# Altium project SR-BMS-Master-Ver1-RevB_lpc407x.PrjPcb
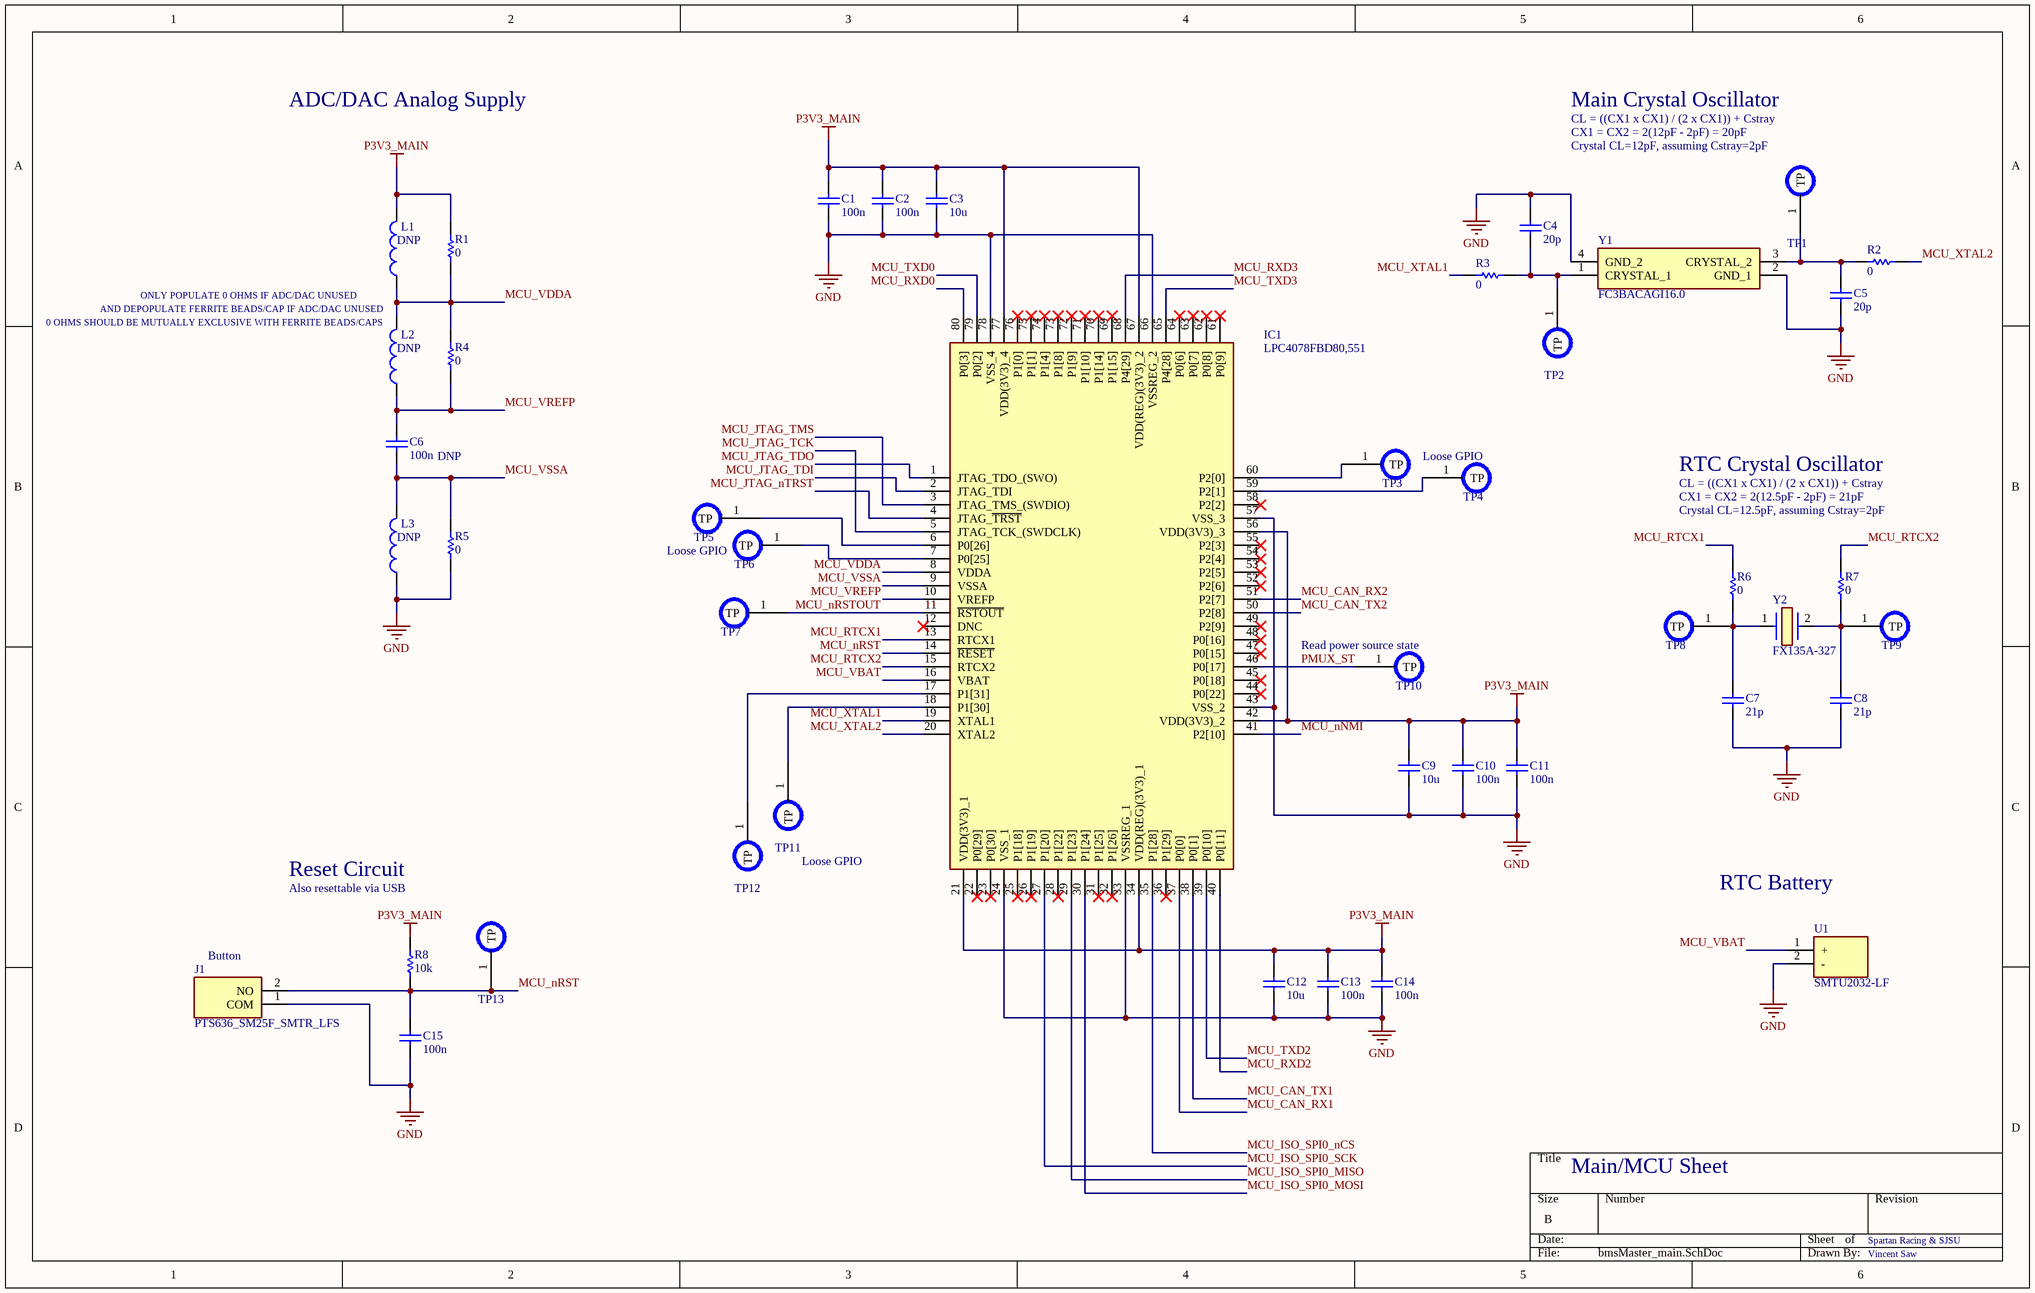
[diagram p0: bmsMaster_main.SchDoc]
7 sheets, 132 parts. Net scope: global (net labels, ports and power ports of the same name join across sheets).
Board file: bmsMaster.PcbDoc
Sheets:
  bmsMaster_main.SchDoc
  bmsMaster_conn.SchDoc
  bmsMaster_power.SchDoc
  bmsMaster_usb.SchDoc
  bmsMaster_isospi.SchDoc
  bmsMaster_can.SchDoc
  bmsMaster_led.SchDoc

## Sheet bmsMaster_main.SchDoc
size B; SheetNumber: 1; SheetTotal: 7

### Parts
C1  value 100n  [CAPC1608X90N]  (hidden comment: Capacitor)
C2  value 100n  [CAPC1608X90N]  (hidden comment: Capacitor)
C3  value 10u  [CAPC1608X90N]  (hidden comment: Capacitor)
C4  value 20p  [CAPC1608X90N]  (hidden comment: Capacitor)
C5  value 20p  [CAPC1608X90N]  (hidden comment: Capacitor)
C6  value 100n  [CAPC1608X90N]  (hidden comment: Capacitor)
C7  value 21p  [CAPC1608X90N]  (hidden comment: Capacitor)
C8  value 21p  [CAPC1608X90N]  (hidden comment: Capacitor)
C9  value 10u  [CAPC1608X90N]  (hidden comment: Capacitor)
C10  value 100n  [CAPC1608X90N]  (hidden comment: Capacitor)
C11  value 100n  [CAPC1608X90N]  (hidden comment: Capacitor)
C12  value 10u  [CAPC1608X90N]  (hidden comment: Capacitor)
C13  value 100n  [CAPC1608X90N]  (hidden comment: Capacitor)
C14  value 100n  [CAPC1608X90N]  (hidden comment: Capacitor)
C15  value 100n  [CAPC1608X90N]  (hidden comment: Capacitor)
IC1  LPC4078FBD80,551  [QFP50P1400X1400X160-80N]
J1  PTS636_SM25F_SMTR_LFS  [PTS636SM25FSMTRLFS]
L1  Inductor  [BEADC1608X95N]  (value not drawn)
L2  Inductor  [BEADC1608X95N]  (value not drawn)
L3  Inductor  [BEADC1608X95N]  (value not drawn)
R1  value 0  [RESC1608X50N]  (hidden comment: Resistor)
R2  value 0  [RESC1608X50N]  (hidden comment: Resistor)
R3  value 0  [RESC1608X50N]  (hidden comment: Resistor)
R4  value 0  [RESC1608X50N]  (hidden comment: Resistor)
R5  value 0  [RESC1608X50N]  (hidden comment: Resistor)
R6  value 0  [RESC1608X50N]  (hidden comment: Resistor)
R7  value 0  [RESC1608X50N]  (hidden comment: Resistor)
R8  value 10k  [RESC1608X50N]  (hidden comment: Resistor)
TP1  TSTPT  [Testpoint1]  (value not drawn)  (no BOM)
TP2  TSTPT  [Testpoint1]  (value not drawn)  (no BOM)
TP3  TSTPT  [Testpoint1]  (value not drawn)  (no BOM)
TP4  TSTPT  [Testpoint1]  (value not drawn)  (no BOM)
TP5  TSTPT  [Testpoint1]  (value not drawn)  (no BOM)
TP6  TSTPT  [Testpoint1]  (value not drawn)  (no BOM)
TP7  TSTPT  [Testpoint1]  (value not drawn)  (no BOM)
TP8  TSTPT  [Testpoint1]  (value not drawn)  (no BOM)
TP9  TSTPT  [Testpoint1]  (value not drawn)  (no BOM)
TP10  TSTPT  [Testpoint1]  (value not drawn)  (no BOM)
TP11  TSTPT  [Testpoint1]  (value not drawn)  (no BOM)
TP12  TSTPT  [Testpoint1]  (value not drawn)  (no BOM)
TP13  TSTPT  [Testpoint1]  (value not drawn)  (no BOM)
U1  SMTU2032-LF  [SMTU2032LF]
Y1  FC3BACAGI16.0  [FC3BACAGI160]
Y2  FX135A-327  [FX135A327]

### Nets
GND: C1.1 C2.1 C3.1 C4.2 C5.1 C7.1 C8.1 C9.1 C10.1 C11.1 C12.1 C13.1 C14.1 C15.1 IC1.24(VSS_1) IC1.33(VSSREG_1) IC1.43(VSS_2) IC1.57(VSS_3) IC1.66(VSSREG_2) IC1.78(VSS_4) J1.1(COM) L3.1 R5.1 U1.2(-) Y1.2(GND_1) Y1.4(GND_2)
P3V3_MAIN: C1.2 C2.2 C3.2 C9.2 C10.2 C11.2 C12.2 C13.2 C14.2 IC1.21(VDD(3V3)_1) IC1.34(VDD(REG)(3V3)_1) IC1.42(VDD(3V3)_2) IC1.56(VDD(3V3)_3) IC1.67(VDD(REG)(3V3)_2) IC1.77(VDD(3V3)_4) L1.2 R1.2 R8.2
MCU_CAN_RX1: IC1.37(P0[0])
MCU_CAN_RX2: IC1.51(P2[7])
MCU_CAN_TX1: IC1.38(P0[1])
MCU_CAN_TX2: IC1.50(P2[8])
MCU_ISO_SPI0_MISO: IC1.29(P1[23])
MCU_ISO_SPI0_MOSI: IC1.30(P1[24])
MCU_ISO_SPI0_nCS: IC1.35(P1[28])
MCU_ISO_SPI0_SCK: IC1.27(P1[20])
MCU_JTAG_nTRST: IC1.4(JTAG_~{TRST})
MCU_JTAG_TCK: IC1.5(JTAG_TCK_(SWDCLK))
MCU_JTAG_TDI: IC1.2(JTAG_TDI)
MCU_JTAG_TDO: IC1.1(JTAG_TDO_(SWO))
MCU_JTAG_TMS: IC1.3(JTAG_TMS_(SWDIO))
MCU_nNMI: IC1.41(P2[10])
MCU_nRST: C15.2 IC1.14(~{RESET}) J1.2(NO) R8.1 TP13.1(TP)
MCU_nRSTOUT: IC1.11(~{RSTOUT}) TP7.1(TP)
MCU_RTCX1: IC1.13(RTCX1) R6.1
MCU_RTCX2: IC1.15(RTCX2) R7.1
MCU_RXD0: IC1.80(P0[3])
MCU_RXD2: IC1.40(P0[11])
MCU_RXD3: IC1.68(P4[29])
MCU_TXD0: IC1.79(P0[2])
MCU_TXD2: IC1.39(P0[10])
MCU_TXD3: IC1.65(P4[28])
MCU_VBAT: IC1.16(VBAT) U1.1(+)
MCU_VDDA: IC1.8(VDDA) L1.1 L2.2 R1.1 R4.2
MCU_VREFP: C6.2 IC1.10(VREFP) L2.1 R4.1
MCU_VSSA: C6.1 IC1.9(VSSA) L3.2 R5.2
MCU_XTAL1: IC1.19(XTAL1) R3.2
MCU_XTAL2: IC1.20(XTAL2) R2.1
PMUX_ST: IC1.46(P0[17]) TP10.1(TP)
NetC4_1: C4.1 R3.1 TP2.1(TP) Y1.1(CRYSTAL_1)
NetC5_2: C5.2 R2.2 TP1.1(TP) Y1.3(CRYSTAL_2)
NetC7_2: C7.2 R6.2 TP8.1(TP) Y2.1
NetC8_2: C8.2 R7.2 TP9.1(TP) Y2.2
NetIC1_6: IC1.6(P0[26]) TP5.1(TP)
NetIC1_7: IC1.7(P0[25]) TP6.1(TP)
NetIC1_17: IC1.17(P1[31]) TP12.1(TP)
NetIC1_18: IC1.18(P1[30]) TP11.1(TP)
NetIC1_59: IC1.59(P2[1]) TP4.1(TP)
NetIC1_60: IC1.60(P2[0]) TP3.1(TP)

Not connected (* = marked no-connect by the designer): IC1 12(DNC)* 22(P0[29])* 23(P0[30])* 25(P1[18])* 26(P1[19])* 28(P1[22])* 31(P1[25])* 32(P1[26])* 36(P1[29])* 44(P0[22])* 45(P0[18])* 47(P0[15])* 48(P0[16])* 49(P2[9])* 52(P2[6])* 53(P2[5])* 54(P2[4])* 55(P2[3])* 58(P2[2])* 61(P0[9])* 62(P0[8])* 63(P0[7])* 64(P0[6])* 69(P1[15])* 70(P1[14])* 71(P1[10])* 72(P1[9])* 73(P1[8])* 74(P1[4])* 75(P1[1])* 76(P1[0])*

### Notes on the sheet
- ADC/DAC Analog Supply
- Main Crystal Oscillator
- CL = ((CX1 x CX1) / (2 x CX1)) + Cstray
- CX1 = CX2 = 2(12pF - 2pF) = 20pF
- (near TP1) Crystal CL=12pF, assuming Cstray=2pF
- ONLY POPULATE 0 OHMS IF ADC/DAC UNUSED
- (near L1) DNP
- 0 OHMS SHOULD BE MUTUALLY EXCLUSIVE WITH FERRITE BEADS/CAPS
- AND DEPOPULATE FERRITE BEADS/CAP IF ADC/DAC UNUSED
- (near L2) DNP
- (near C6) DNP
- (near TP4) Loose GPIO
- RTC Crystal Oscillator
- CX1 = CX2 = 2(12.5pF - 2pF) = 21pF
- (near L3) DNP
- Loose GPIO
- Crystal CL=12.5pF, assuming Cstray=2pF
- (near TP10) Read power source state
- Reset Circuit
- Also resettable via USB
- RTC Battery
- (near J1) Button
- Main/MCU Sheet
- Spartan Racing & SJSU
- Vincent Saw

### Library data of the parts
C1-C15 = Capacitor: SimulationGenericComponent: True
IC1 = LPC4078FBD80,551: Integrated Circuit; Manufacturer_Name: NXP; Datasheet Link: http://www.nxp.com/docs/en/data-sheet/LPC408X_7X.pdf; Height: 1.6mm; Manufacturer_Part_Number: LPC4078FBD80,551; Mouser Part Number: 771-LPC4078FBD80551; Mouser Price/Stock: https://www.mouser.co.uk/ProductDetail/NXP-Semiconductors/LPC4078FBD80551?qs=vnbNJPHmPnPMtBCcoSguaA%3D%3D; Arrow Part Number: LPC4078FBD80,551; Arrow Price/Stock: https://www.arrow.com/en/products/lpc4078fbd80551/nxp-semiconductors
J1 = PTS636_SM25F_SMTR_LFS: Connector; Manufacturer_Name: C & K COMPONENTS; Manufacturer_Part_Number: PTS636 SM25F SMTR LFS; Datasheet Link: https://ms.componentsearchengine.com/Datasheets/1/PTS636 SM25F SMTR LFS.pdf; Height: 2.7mm; Mouser Part Number: 611-PTS636SM25FSMTRL; Mouser Price/Stock: https://www.mouser.co.uk/ProductDetail/CK/PTS636-SM25F-SMTR-LFS?qs=vLWxofP3U2wcBTQSwfMFOw%3D%3D; Arrow Part Number: PTS636 SM25F SMTR LFS; Arrow Price/Stock: https://www.arrow.com/en/products/pts636-sm25f-smtr-lfs/ck
L1-L3 = Inductor: SimulationGenericComponent: True
R1-R7 = Resistor: SimulationGenericComponent: True; TC1: 0; TC2: 0
R8 = Resistor: TC1: 0; SimulationGenericComponent: True; TC2: 0
TP1-TP13 = Testpoint1
U1 = SMTU2032-LF: Undefined or Miscellaneous; Manufacturer_Name: RENATA; Datasheet Link: https://componentsearchengine.com/Datasheets/1/SMTU2032-LF.pdf; Height: 5mm; Manufacturer_Part_Number: SMTU2032-LF; Mouser Part Number: 614-SMTU2032-LF; Mouser Price/Stock: https://www.mouser.co.uk/ProductDetail/Renata/SMTU2032-LF?qs=r1PAtlylphCLeXbokB9Tog%3D%3D
Y1 = FC3BACAGI16.0: Crystal or Oscillator; Manufacturer_Name: Fox; Datasheet Link: https://www.foxonline.com/wp-content/uploads/pdfs/C3BA.pdf; Height: 0.8mm; Manufacturer_Part_Number: FC3BACAGI16.0; Mouser Part Number: 559-FC3BACAGI16.0; Mouser Price/Stock: https://www.mouser.co.uk/ProductDetail/Fox/FC3BACAGI160?qs=W0yvOO0ixfHpyQil83gR7Q%3D%3D
Y2 = FX135A-327: Crystal or Oscillator; Manufacturer_Name: Fox; Datasheet Link: https://componentsearchengine.com/Datasheets/2/FX135A-327.pdf; Height: 0.9mm; Manufacturer_Part_Number: FX135A-327; Mouser Part Number: 559-FX135A-327; Mouser Price/Stock: https://www.mouser.co.uk/ProductDetail/Fox-Abracon/FX135A-327?qs=n5MbhIql%252BRlKJidsig7mKQ%3D%3D

## Sheet bmsMaster_conn.SchDoc
size A; SheetNumber: 2; SheetTotal: 7
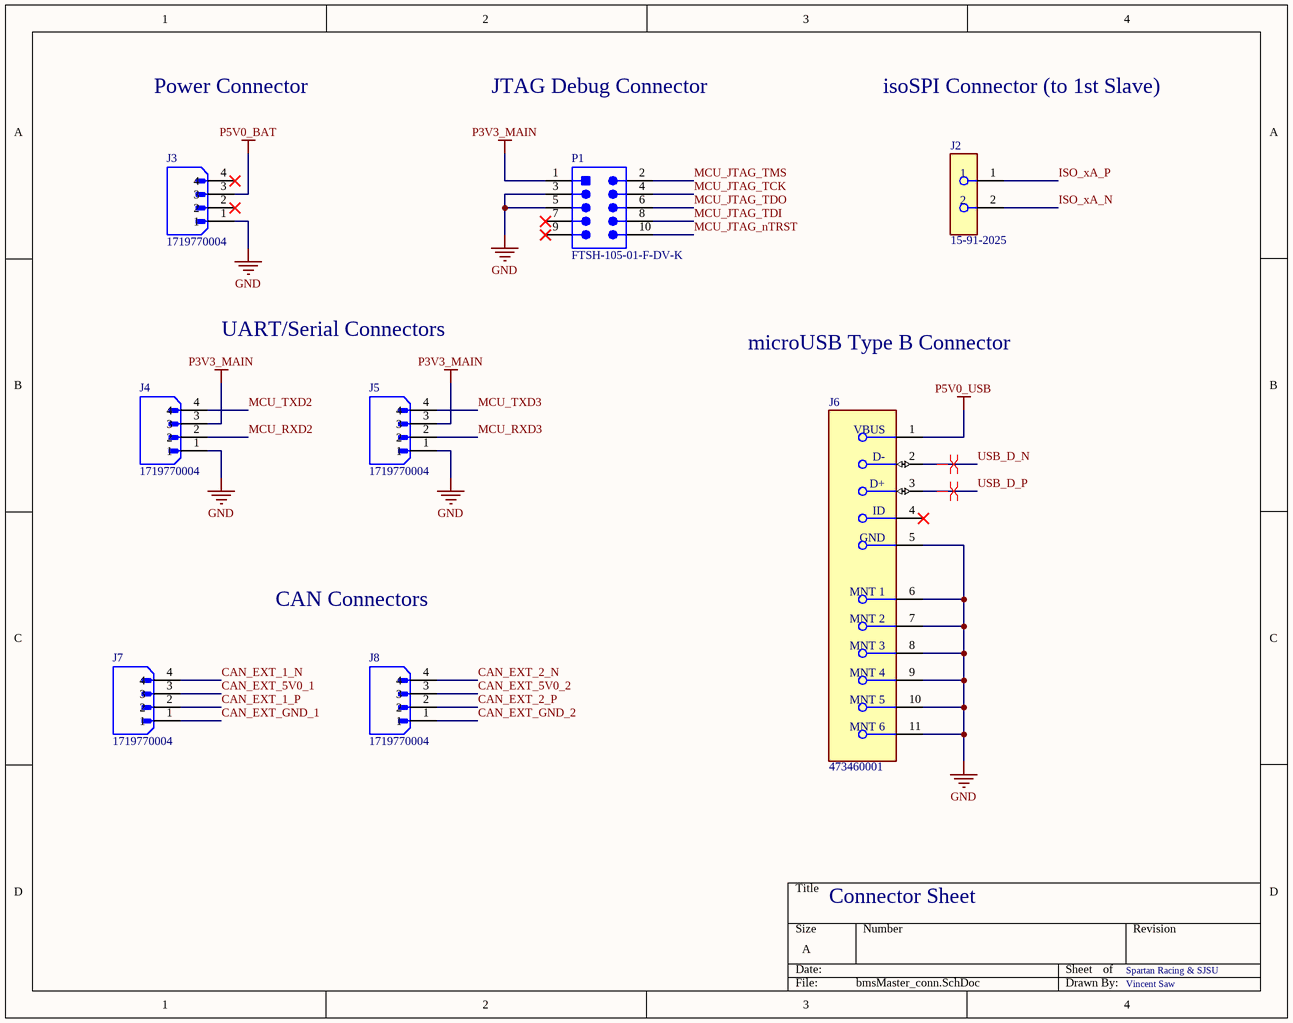
[diagram p1: bmsMaster_conn.SchDoc]

### Parts
J2  15-91-2025  [FP-15-91-2025-MFG]
J3  1719770004  [MOLEX_1719770004]
J4  1719770004  [MOLEX_1719770004]
J5  1719770004  [MOLEX_1719770004]
J6  473460001  [FP-473460001-MFG]
J7  1719770004  [MOLEX_1719770004]
J8  1719770004  [MOLEX_1719770004]
P1  FTSH-105-01-F-DV-K  [SMTC-FTSH-105-01-L-DV-K_V]

### Nets
GND: J3.1 J4.1 J5.1 J6.5(GND) J6.6(MNT_1) J6.7(MNT_2) J6.8(MNT_3) J6.9(MNT_4) J6.10(MNT_5) J6.11(MNT_6) P1.3 P1.5
P3V3_MAIN: J4.3 J5.3 P1.1
P5V0_BAT: J3.3
P5V0_USB: J6.1(VBUS)
CAN_EXT_1_N: J7.4
CAN_EXT_1_P: J7.2
CAN_EXT_2_N: J8.4
CAN_EXT_2_P: J8.2
CAN_EXT_5V0_1: J7.3
CAN_EXT_5V0_2: J8.3
CAN_EXT_GND_1: J7.1
CAN_EXT_GND_2: J8.1
ISO_xA_N: J2.2
ISO_xA_P: J2.1
MCU_JTAG_nTRST: P1.10
MCU_JTAG_TCK: P1.4
MCU_JTAG_TDI: P1.8
MCU_JTAG_TDO: P1.6
MCU_JTAG_TMS: P1.2
MCU_RXD2: J4.2
MCU_RXD3: J5.2
MCU_TXD2: J4.4
MCU_TXD3: J5.4
USB_D_N: J6.2(D-)
USB_D_P: J6.3(D+)

Not connected (* = marked no-connect by the designer): J3 2* 4*; J6 4(ID)*; P1 7* 9*

### Layout directives
differential pair: USB_D_N, USB_D_P

### Notes on the sheet
- Power Connector
- JTAG Debug Connector
- isoSPI Connector (to 1st Slave)
- UART/Serial Connectors
- microUSB Type B Connector
- CAN Connectors
- Connector Sheet
- Spartan Racing & SJSU
- Vincent Saw

### Library data of the parts
J2 = CMP-04776-000618-1: CONN HEADER SMD R/A 2POS 2.54MM; Number of Contacts: 2; Voltage Rating: 250V; Max Current Rating: 1.75A; Contact Resistance: 30mR; Current Rating: 3A; Insulation Resistance: 1GR; Gender: Male; Glow Wire Compliant: Non-compliant; Contact Mating Length: 0.24inch; Max Operating Temperature: 105°C; Length: 8.64mm; Color: Black; REACH SVHC: No SVHC; Depth: 13.59mm; ELV: Compliant; Material: Brass; Contact Type: Male Pin; Number of Rows: 1; Number of Positions: 2; Housing Color: Black; Pitch: 2.54mm; Housing Material: Polyester; Flammability Rating: UL94 V-0; Packaging: Rail/Tube; RoHS Compliant: Yes; Radiation Hardening: No; Min Operating Temperature: -40°C; Termination: Solder; Mount: Surface Mount; Contact Plating: Gold; Package Quantity: 1830; Height: 5.56mm; Contact Material: Bronze; Orientation: Right Angle; Number of Circuits: 2; Lead Free: Contains Lead; Voltage Rating (DC): 250V; Series: C-Grid® SL™ 70634; Contact Gender: Male
J3-J5 J7 J8 = 1719770004: 2.54mm Pitch SL Header, Single Row, Right-Angle, LCP, Shrouded, Surface Mount, with Pegs, Matte Tin (Sn) Plating, 4 Circuits, Tube; MF: {'manufacturer': u'Molex'}; Price: None; Value: *; MP: 1719770004; Package: None; Availability: Unavailable
J6 = CMP-2000-05246-2: CONN RCPT USB2.0 MICRO B SMD R/A; Manufacturer: Molex; Conn Orientation: Right Angle; Is Female: yes; Shielding: true; Pitch: 0.65mm; Number Of Contacts: 5; Voltage Rating: 30V; Current Rating: 1.8A; Device Class L2: USB Connectors; Digikey Description: CONN RCPT USB2.0 MICRO B SMD R/A; Height: 2.945mm; RoHS: TRUE; ComponentLink2Description: Datasheet; Octopart: https://octopart.com/47346-0001-molex-7164928; Automotive: No; Package: 0; Category: Conn; Device Class L1: Connectors; Usb Standard: USB 2.0; Temperature: -30°C to +85°C; Temperature Range Low: -30°C; Footprint Url: https://www.molex.com/pdm_docs/sd/473460001_sd.pdf; ComponentLink2URL: https://www.molex.com/webdocs/datasheets/pdf/en-us/0473460001_IO_CONNECTORS.pdf; Lead Free: Yes; Manufacturer Part Number: 473460001; Contact Material: Gold,Nickel; Temperature Range High: +85°C; Device Class L3: unset
P1 = CMP-2000-05352-1: Male Header, Pitch 1.27 mm, 2 x 5 Position, Height 6.12 mm, RoHS, Tube; Manufacturer: Samtec; Number of Positions: 10; Connector Type: Header,Shrouded; Number of Positions Loaded: All; Row Spacing: 0.050"(1.27mm); Fastening Type: -; Package Reference: FTSH-105-01-L-DV-K; Termination: Solder; Package URL: http://suddendocs.samtec.com/prints/ftsh-1xx-xx-xxx-dv-xxx-footprint.pdf; Number of Rows: 2; Contact Finish Thickness: 3µin(0.08µm); Contact Type: MalePin; Manufacturer URL: http://www.samtec.com/; Contact Mating Length: 0.120"(3.05mm); Pitch: 0.050"(1.27mm); Series: FTSH; Features: -; Contact Finish: Gold; Color: Black; Family: RectangularConnectors-Headers,MalePins; Datasheet URL: http://suddendocs.samtec.com/prints/ftsh-1xx-xx-xxx-dv-xxx-mkt.pdf; Package Description: Male Header, Pitch 1.27 mm, 2 x 5 Position, Height 5.97 mm, Tail Length 4.32 mm; Mounting Type: SurfaceMount; Datasheet Version: Rev. ET, 10/1995; Category: Connectors,Interconnects; Packaging: Tube

## Sheet bmsMaster_power.SchDoc
size A; SheetNumber: 3; SheetTotal: 7
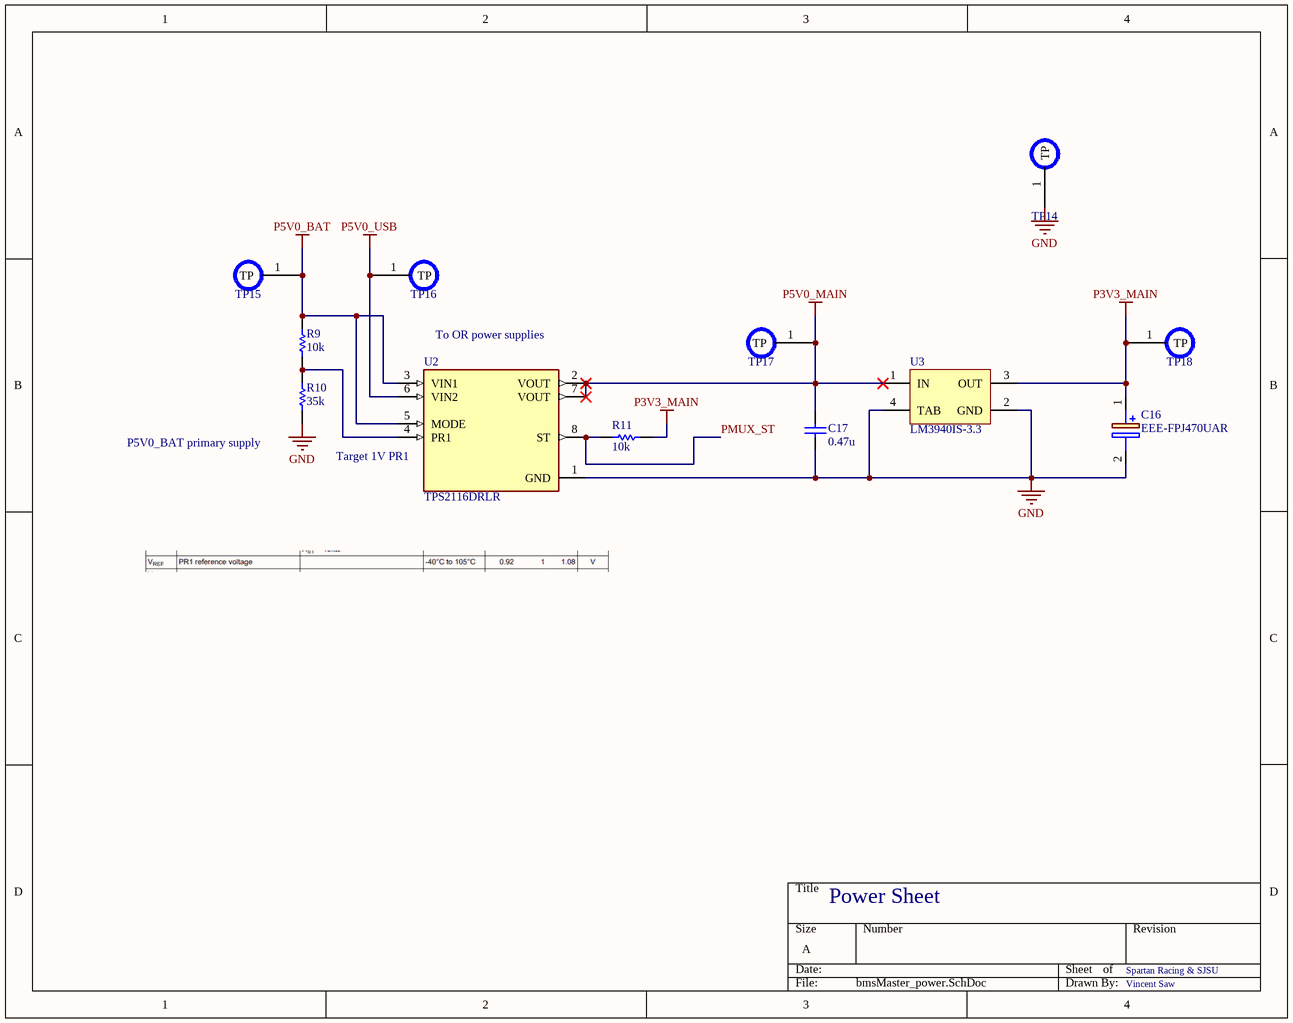
[diagram p2: bmsMaster_power.SchDoc]

### Parts
C16  EEE-FPJ470UAR  [EEE1AA220WR]
C17  value 0.47u  [CAPC1608X90N]  (hidden comment: Capacitor)
R9  value 10k  [RESC1608X50N]  (hidden comment: Resistor)
R10  value 35k  [RESC1608X50N]  (hidden comment: Resistor)
R11  value 10k  [RESC1608X50N]  (hidden comment: Resistor)
TP14  TSTPT  [Testpoint1]  (value not drawn)  (no BOM)
TP15  TSTPT  [Testpoint1]  (value not drawn)  (no BOM)
TP16  TSTPT  [Testpoint1]  (value not drawn)  (no BOM)
TP17  TSTPT  [Testpoint1]  (value not drawn)  (no BOM)
TP18  TSTPT  [Testpoint1]  (value not drawn)  (no BOM)
U2  TPS2116DRLR  [SOTFL50P160X60-8N]
U3  LM3940IS-3.3  [KTT0003B_N]

### Nets
GND: C16.2(-) C17.1 R10.1 TP14.1(TP) U2.1(GND) U3.2(GND) U3.4(TAB)
P3V3_MAIN: C16.1(+) R11.1 TP18.1(TP) U3.3(OUT)
P5V0_BAT: R9.2 TP15.1(TP) U2.3(VIN1) U2.5(MODE)
P5V0_MAIN: C17.2 TP17.1(TP) U2.2(VOUT) U2.7(VOUT) U3.1(IN)
P5V0_USB: TP16.1(TP) U2.6(VIN2)
PMUX_ST: R11.2 U2.8(ST)
NetR9_1: R9.1 R10.2 U2.4(PR1)

### Notes on the sheet
- To OR power supplies
- (near R10) P5V0_BAT primary supply
- (near U2) Target 1V PR1
- Power Sheet
- Spartan Racing & SJSU
- Vincent Saw

### Library data of the parts
C16 = EEE-FPJ470UAR: Capacitor Polarised; Manufacturer_Name: Panasonic; Datasheet Link: http://industrial.panasonic.com/cdbs/www-data/pdf/RDE0000/ABA0000C1184.pdf; Height: 5.5mm; Manufacturer_Part_Number: EEE-FPJ470UAR; Mouser Part Number: 667-EEE-FPJ470UAR; Mouser Price/Stock: https://www.mouser.com/Search/Refine.aspx?Keyword=667-EEE-FPJ470UAR
C17 = Capacitor: SimulationGenericComponent: True
R9-R11 = Resistor: TC1: 0; SimulationGenericComponent: True; TC2: 0
TP14-TP18 = Testpoint1
U2 = TPS2116DRLR: 1.6 V to 5.5 V, 2.5-A Low IQ Power Mux with Manual and Priority Switchover; MF: {'manufacturer': u'Texas Instruments'}; Value: *; Price: None; Package: None; Availability: Unavailable; MP: TPS2116DRLR
U3 = CMP-0062-00201-4: 1A Low Dropout Regulator for 5V to 3.3V Conversion, 3-pin TO-263; Manufacturer: Texas Instruments; CompType: LDO IC; PowerWise: N; PackageTopMarking: NSUZXYTTE#*LM3940IS*-3.3 P+; PinCount: 3; Code_JEDEC: MO-169-AA; PackageReference: KTT0003B; ComponentLink1URL: http://www.ti.com/general/docs/lit/getliterature.tsp?genericPartNumber=LM3940&fileType=pdf; RoHS: N; PackageDescription: TO-263, Molded, .400 x .390 x .180in, 3 Lead, .1in Pitch, Surface Mount; ComponentLink1Description: Datasheet URL

## Sheet bmsMaster_usb.SchDoc
size A; SheetNumber: 4; SheetTotal: 7
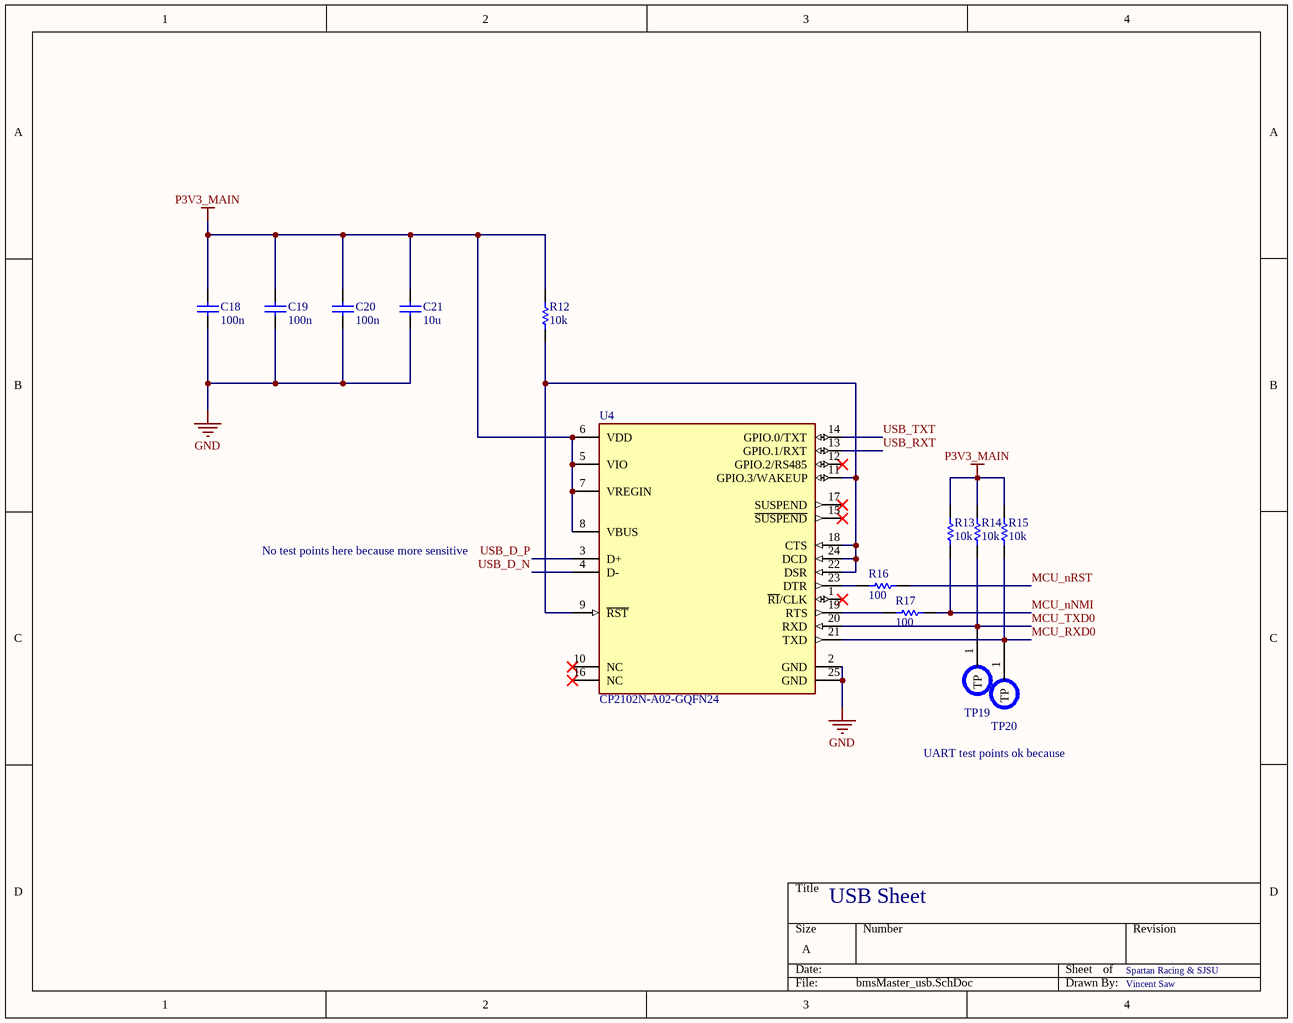
[diagram p3: bmsMaster_usb.SchDoc]

### Parts
C18  value 100n  [CAPC1608X90N]  (hidden comment: Capacitor)
C19  value 100n  [CAPC1608X90N]  (hidden comment: Capacitor)
C20  value 100n  [CAPC1608X90N]  (hidden comment: Capacitor)
C21  value 10u  [CAPC1608X90N]  (hidden comment: Capacitor)
R12  value 10k  [RESC1608X50N]  (hidden comment: Resistor)
R13  value 10k  [RESC1608X50N]  (hidden comment: Resistor)
R14  value 10k  [RESC1608X50N]  (hidden comment: Resistor)
R15  value 10k  [RESC1608X50N]  (hidden comment: Resistor)
R16  value 100  [RESC1608X50N]  (hidden comment: Resistor)
R17  value 100  [RESC1608X50N]  (hidden comment: Resistor)
TP19  TSTPT  [Testpoint1]  (value not drawn)  (no BOM)
TP20  TSTPT  [Testpoint1]  (value not drawn)  (no BOM)
U4  CP2102N-A02-GQFN24  [FP-CP2102N-A02-GQFN24-MFG]

### Nets
GND: C18.1 C19.1 C20.1 C21.1 U4.2(GND) U4.25(GND)
P3V3_MAIN: C18.2 C19.2 C20.2 C21.2 R12.2 R13.2 R14.2 R15.2 U4.5(VIO) U4.6(VDD) U4.7(VREGIN) U4.8(VBUS)
MCU_nNMI: R13.1 R17.1
MCU_nRST: R16.1
MCU_RXD0: R15.1 TP20.1(TP) U4.21(TXD)
MCU_TXD0: R14.1 TP19.1(TP) U4.20(RXD)
USB_D_N: U4.4(D-)
USB_D_P: U4.3(D+)
USB_RXT: U4.13(GPIO.1/RXT)
USB_TXT: U4.14(GPIO.0/TXT)
NetR12_1: R12.1 U4.9(~{RST}) U4.11(GPIO.3/WAKEUP) U4.18(CTS) U4.22(DSR) U4.24(DCD)
NetR16_2: R16.2 U4.23(DTR)
NetR17_2: R17.2 U4.19(RTS)

Not connected (* = marked no-connect by the designer): U4 1(~{RI}/CLK)* 10(NC)* 12(GPIO.2/RS485)* 15(~{SUSPEND})* 16(NC)* 17(SUSPEND)*

### Notes on the sheet
- No test points here because more sensitive
- UART test points ok because
- USB Sheet
- Spartan Racing & SJSU
- Vincent Saw

### Library data of the parts
C18-C21 = Capacitor: SimulationGenericComponent: True
R12-R17 = Resistor: TC1: 0; SimulationGenericComponent: True; TC2: 0
TP19 TP20 = Testpoint1
U4 = CMP-08107-000010-1: IC USB TO UART BRIDGE QFN24

## Sheet bmsMaster_isospi.SchDoc
size A; SheetNumber: 5; SheetTotal: 7
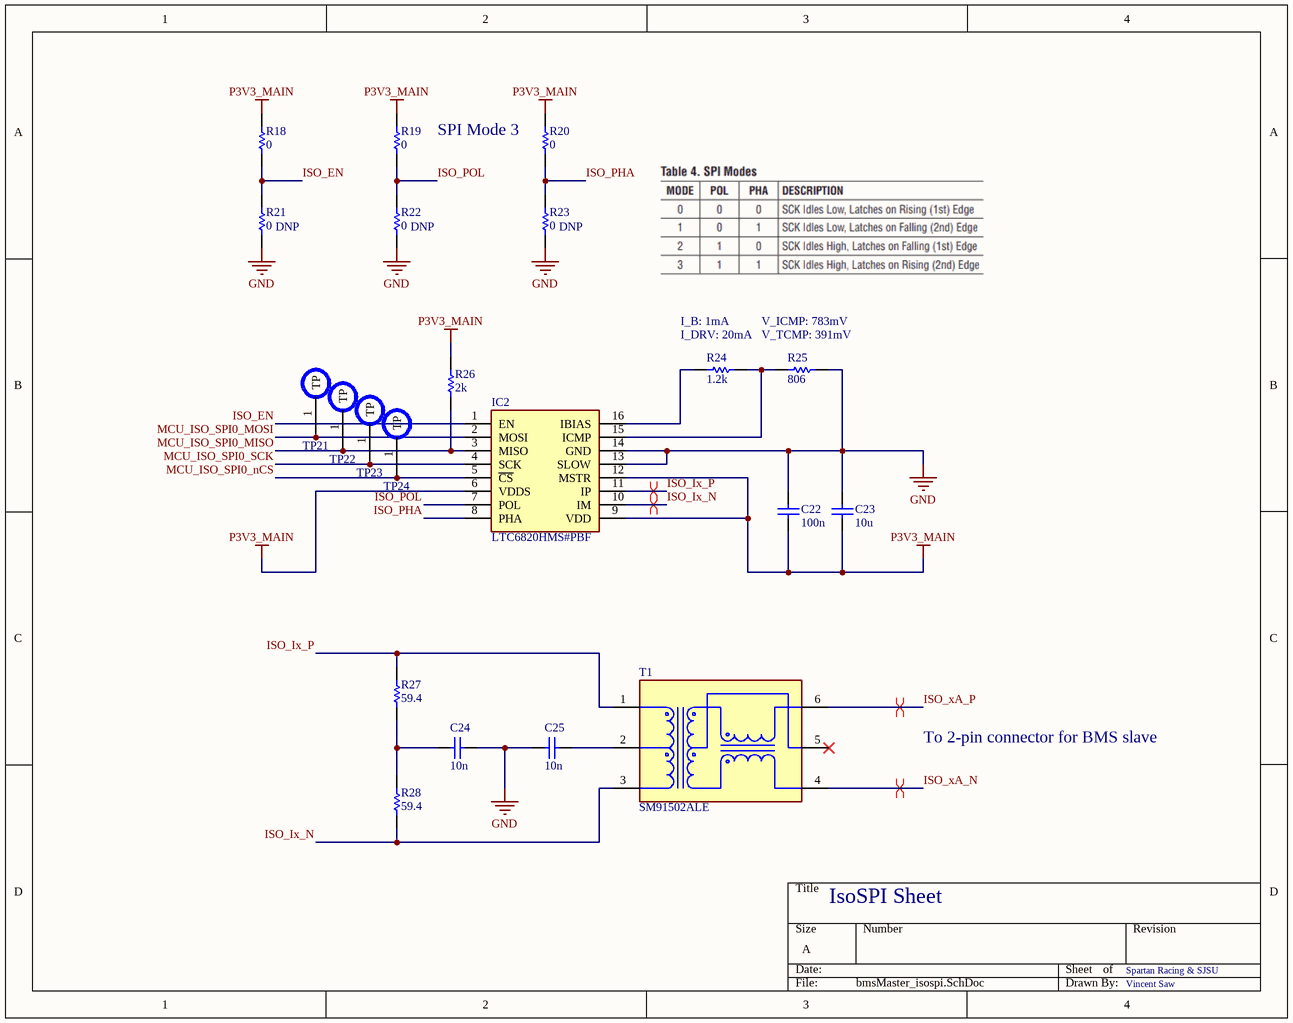
[diagram p4: bmsMaster_isospi.SchDoc]

### Parts
C22  value 100n  [CAPC1608X90N]  (hidden comment: Capacitor)
C23  value 10u  [CAPC1608X90N]  (hidden comment: Capacitor)
C24  value 10n  [CAPC1608X90N]  (hidden comment: Capacitor)
C25  value 10n  [CAPC1608X90N]  (hidden comment: Capacitor)
IC2  LTC6820HMS#PBF  [SOP50P490X110-16N]
R18  value 0  [RESC1608X50N]  (hidden comment: Resistor)
R19  value 0  [RESC1608X50N]  (hidden comment: Resistor)
R20  value 0  [RESC1608X50N]  (hidden comment: Resistor)
R21  value 0  [RESC1608X50N]  (hidden comment: Resistor)
R22  value 0  [RESC1608X50N]  (hidden comment: Resistor)
R23  value 0  [RESC1608X50N]  (hidden comment: Resistor)
R24  value 1.2k  [RESC1608X50N]  (hidden comment: Resistor)
R25  value 806  [RESC1608X50N]  (hidden comment: Resistor)
R26  value 2k  [RESC1608X50N]  (hidden comment: Resistor)
R27  value 59.4  [RESC1608X50N]  (hidden comment: Resistor)
R28  value 59.4  [RESC1608X50N]  (hidden comment: Resistor)
T1  SM91502ALE  [FP-SM91502ALE-MFG]
TP21  TSTPT  [Testpoint1]  (value not drawn)  (no BOM)
TP22  TSTPT  [Testpoint1]  (value not drawn)  (no BOM)
TP23  TSTPT  [Testpoint1]  (value not drawn)  (no BOM)
TP24  TSTPT  [Testpoint1]  (value not drawn)  (no BOM)

### Nets
GND: C22.2 C23.2 C24.1 C25.1 IC2.13(SLOW) IC2.14(GND) R21.1 R22.1 R23.1 R25.2
P3V3_MAIN: C22.1 C23.1 IC2.6(VDDS) IC2.9(VDD) IC2.12(MSTR) R18.2 R19.2 R20.2 R26.2
ISO_EN: IC2.1(EN) R18.1 R21.2
ISO_Ix_N: IC2.10(IM) R28.1 T1.3
ISO_Ix_P: IC2.11(IP) R27.2 T1.1
ISO_PHA: IC2.8(PHA) R20.1 R23.2
ISO_POL: IC2.7(POL) R19.1 R22.2
ISO_xA_N: T1.4
ISO_xA_P: T1.6
MCU_ISO_SPI0_MISO: IC2.3(MISO) R26.1 TP22.1(TP)
MCU_ISO_SPI0_MOSI: IC2.2(MOSI) TP21.1(TP)
MCU_ISO_SPI0_nCS: IC2.5(~{CS}) TP24.1(TP)
MCU_ISO_SPI0_SCK: IC2.4(SCK) TP23.1(TP)
NetC24_2: C24.2 R27.1 R28.2
NetC25_2: C25.2 T1.2
NetIC2_15: IC2.15(ICMP) R24.2 R25.1
NetIC2_16: IC2.16(IBIAS) R24.1

Not connected (* = marked no-connect by the designer): T1 5*

### Layout directives
differential pair: ISO_Ix_N, ISO_Ix_P, ISO_xA_N, ISO_xA_P

### Notes on the sheet
- (near R20) SPI Mode 3
- (near R21) DNP
- (near R22) DNP
- (near R23) DNP
- (near R24) I_B: 1mA
- (near R24) I_DRV: 20mA
- V_ICMP: 783mV
- V_TCMP: 391mV
- To 2-pin connector for BMS slave
- IsoSPI Sheet
- Spartan Racing & SJSU
- Vincent Saw

### Library data of the parts
C22-C25 = Capacitor: SimulationGenericComponent: True
IC2 = LTC6820HMS#PBF: Integrated Circuit; Manufacturer_Name: Analog Devices; Datasheet Link: https://www.analog.com/media/en/technical-documentation/data-sheets/LTC6820.pdf; Height: 1.1mm; Manufacturer_Part_Number: LTC6820HMS#PBF; Mouser Part Number: 584-LTC6820HMS#PBF; Mouser Price/Stock: https://www.mouser.co.uk/ProductDetail/Analog-Devices/LTC6820HMSPBF?qs=hVkxg5c3xu%252BAhS55eUb%252BEQ%3D%3D; Arrow Part Number: LTC6820HMS#PBF; Arrow Price/Stock: https://www.arrow.com/en/products/ltc6820hmspbf/analog-devices?region=europe
R18-R23 = Resistor: SimulationGenericComponent: True; TC1: 0; TC2: 0
R24-R28 = Resistor: TC1: 0; SimulationGenericComponent: True; TC2: 0
T1 = CMP-07264-000001-1: BMS XFORMER 1-CH 1000V AECQ +125; Manufacturer: Bourns; Standoff Height: 0.13mm; Turns Ratio: 1:1; Automotive Grade: Grade 1; Isolation Voltage: 4300VDC; Return Loss: -22dB; Insertion Loss: -0.25dB; Height: 5.72mm; Automotive: Yes; Package: 0; Device Class L3: unset; ComponentLink2Description: Datasheet; Category: Trans; ComponentLink2URL: https://www.bourns.com/docs/product-datasheets/SM91502AL.pdf; Device Class L1: Passive Components; Manufacturer Part Number: SM91502ALE; Temperature Range High: +125°C; Digikey Description: BMS XFORMER 1-CH 1000V AECQ +125; RoHS: TRUE; Lead Free: Yes; Octopart: https://octopart.com/sm91502ale-bourns-95732123; Device Class L2: Transformers; Temperature: -40°C to +125°C; Temperature Range Low: -40°C
TP21-TP24 = Testpoint1

## Sheet bmsMaster_can.SchDoc
size A; SheetNumber: 6; SheetTotal: 7
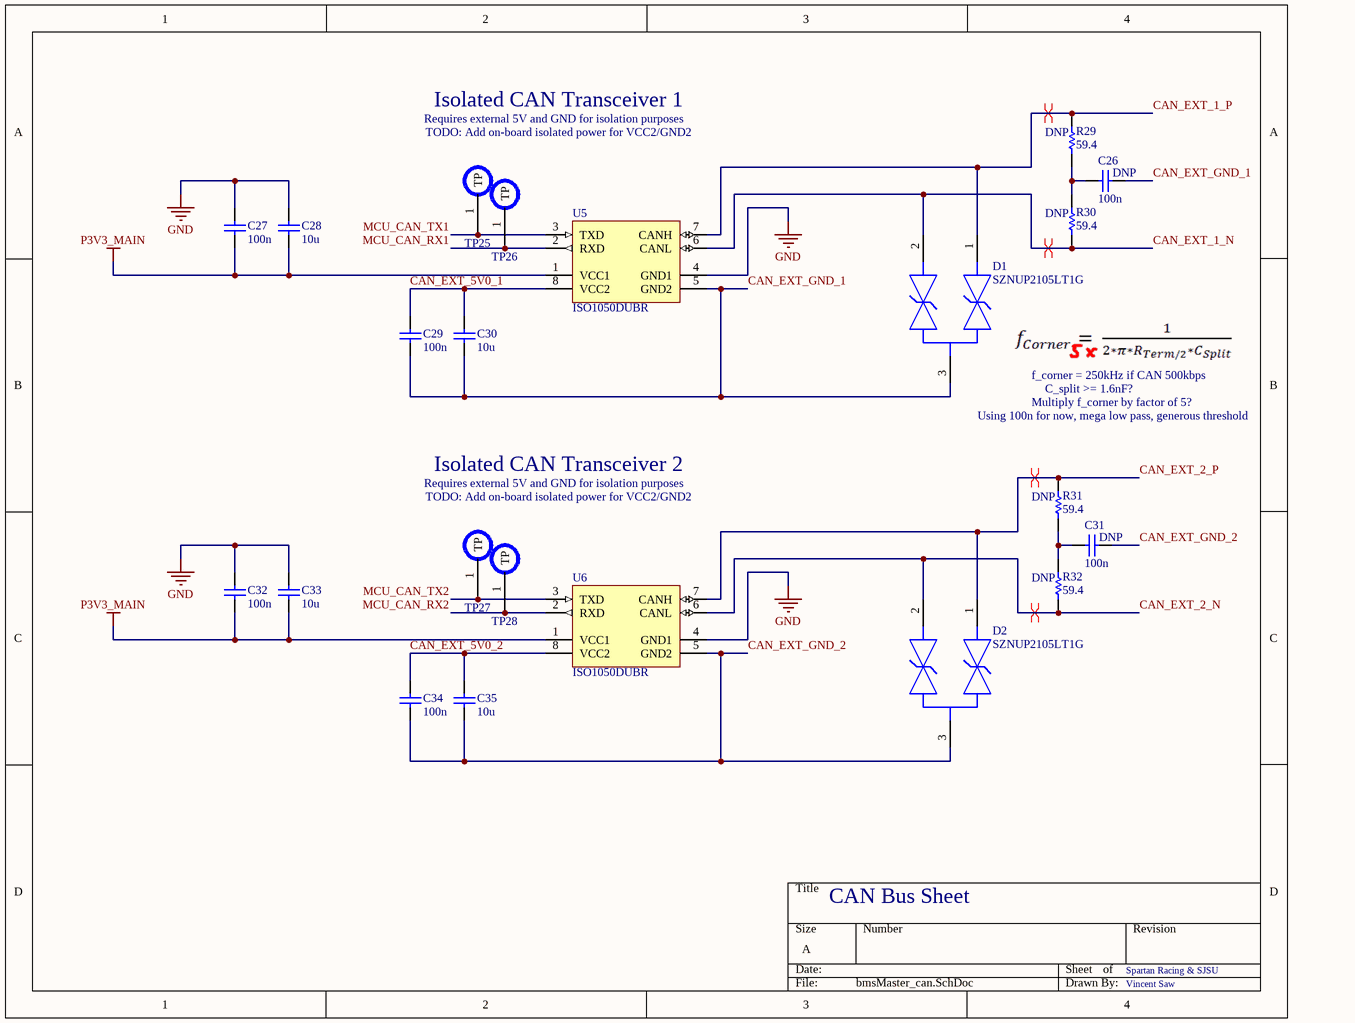
[diagram p5: bmsMaster_can.SchDoc]

### Parts
C26  value 100n  [CAPC1608X90N]  (hidden comment: Capacitor)
C27  value 100n  [CAPC1608X90N]  (hidden comment: Capacitor)
C28  value 10u  [CAPC1608X90N]  (hidden comment: Capacitor)
C29  value 100n  [CAPC1608X90N]  (hidden comment: Capacitor)
C30  value 10u  [CAPC1608X90N]  (hidden comment: Capacitor)
C31  value 100n  [CAPC1608X90N]  (hidden comment: Capacitor)
C32  value 100n  [CAPC1608X90N]  (hidden comment: Capacitor)
C33  value 10u  [CAPC1608X90N]  (hidden comment: Capacitor)
C34  value 100n  [CAPC1608X90N]  (hidden comment: Capacitor)
C35  value 10u  [CAPC1608X90N]  (hidden comment: Capacitor)
D1  SZNUP2105LT1G  [FP-318-08-MFG]
D2  SZNUP2105LT1G  [FP-318-08-MFG]
R29  value 59.4  [RESC1608X50N]  (hidden comment: Resistor)
R30  value 59.4  [RESC1608X50N]  (hidden comment: Resistor)
R31  value 59.4  [RESC1608X50N]  (hidden comment: Resistor)
R32  value 59.4  [RESC1608X50N]  (hidden comment: Resistor)
TP25  TSTPT  [Testpoint1]  (value not drawn)  (no BOM)
TP26  TSTPT  [Testpoint1]  (value not drawn)  (no BOM)
TP27  TSTPT  [Testpoint1]  (value not drawn)  (no BOM)
TP28  TSTPT  [Testpoint1]  (value not drawn)  (no BOM)
U5  ISO1050DUBR  [DUB0008A_L]
U6  ISO1050DUBR  [DUB0008A_L]

### Nets
GND: C27.2 C28.2 C32.2 C33.2 U5.4(GND1) U6.4(GND1)
P3V3_MAIN: C27.1 C28.1 C32.1 C33.1 U5.1(VCC1) U6.1(VCC1)
CAN_EXT_1_N: D1.2 R30.1 U5.6(CANL)
CAN_EXT_1_P: D1.1 R29.2 U5.7(CANH)
CAN_EXT_2_N: D2.2 R32.1 U6.6(CANL)
CAN_EXT_2_P: D2.1 R31.2 U6.7(CANH)
CAN_EXT_5V0_1: C29.2 C30.2 U5.8(VCC2)
CAN_EXT_5V0_2: C34.2 C35.2 U6.8(VCC2)
CAN_EXT_GND_1: C26.1 C29.1 C30.1 D1.3 U5.5(GND2)
CAN_EXT_GND_2: C31.1 C34.1 C35.1 D2.3 U6.5(GND2)
MCU_CAN_RX1: TP26.1(TP) U5.2(RXD)
MCU_CAN_RX2: TP28.1(TP) U6.2(RXD)
MCU_CAN_TX1: TP25.1(TP) U5.3(TXD)
MCU_CAN_TX2: TP27.1(TP) U6.3(TXD)
NetC26_2: C26.2 R29.1 R30.2
NetC31_2: C31.2 R31.1 R32.2

### Layout directives
differential pair: CAN_EXT_1_N, CAN_EXT_1_P, CAN_EXT_2_N, CAN_EXT_2_P

### Notes on the sheet
- Requires external 5V and GND for isolation purposes
- Isolated CAN Transceiver 1
- TODO: Add on-board isolated power for VCC2/GND2
- (near R29) DNP
- (near R30) DNP
- (near C26) DNP
- Using 100n for now, mega low pass, generous threshold
- f_corner = 250kHz if CAN 500kbps
- Multiply f_corner by factor of 5?
- C_split >= 1.6nF?
- Isolated CAN Transceiver 2
- (near R31) DNP
- (near C31) DNP
- (near R32) DNP
- CAN Bus Sheet
- Spartan Racing & SJSU
- Vincent Saw

### Library data of the parts
C26-C35 = Capacitor: SimulationGenericComponent: True
D1 D2 = CMP-1063-00167-2: TVS DIODE 24V 44V SOT23-3; Manufacturer: ON Semiconductor; Capacitance: 30pF; Max Junction Temp: +150°C; Breakdown Voltage: 26.2V; Number Of Channels: 2; Automotive Grade: Grade 0; Standoff Height: 0.01mm; Peak Pulse Current: 8A; Value: 30pF; Direction: Bidirectional; Peak Pulse Power: 350W; Octopart: https://octopart.com/sznup2105lt1g-on+semiconductor-22134626; Reverse Standoff Voltage: 24V; Digikey Description: TVS DIODE 24V 44V SOT23-3; RoHS: TRUE; Manufacturer Part Number: SZNUP2105LT1G; Height: 1.11mm; Automotive: Yes; ComponentLink2URL: https://www.onsemi.com/pub/Collateral/NUP2105L-D.PDF; Device Class L3: unset; Package: 318-08; Lead Free: Yes; Device Class L2: TVS Diodes; Footprint Url: https://www.onsemi.com/pub/Collateral/318-08.PDF; Temperature Range Low: -55°C; Device Class L1: Circuit Protection; Temperature: -55°C to +150°C; Temperature Range High: +150°C; Category: Diode; Clamping Voltage: 44V; ComponentLink2Description: Datasheet
R29-R32 = Resistor: TC1: 0; SimulationGenericComponent: True; TC2: 0
TP25-TP28 = Testpoint1
U5 U6 = CMP-0315-00093-2: Isolated CAN Transceiver, -55 to 105 degC, 8-pin SOP (DUB), Green (RoHS & no Sb/Br); Manufacturer: Texas Instruments; Rating: Catalog; Isolated: Yes; Drivers Per Package: 1; PackageReference: DUB0008A; PartNumber: ISO1050DUBR; ComponentLink2Description: Package Specification; ComponentLink1Description: Datasheet; Mounting Technology: Surface Mount; ComponentLink1URL: http://www.ti.com/general/docs/lit/getliterature.tsp?genericPartNumber=ISO1050&fileType=pdf; ComponentLink2URL: http://www.ti.com/litv/pdf/mpds247b; Eco-Plan: Green (RoHS & no Sb/Br); PackageDescription: 8-Pin Small Outline Package 2.54 mm Pitch; PackageVersion: revC, May-2006; SubFamily: CAN; DatasheetVersion: SLLS983E

## Sheet bmsMaster_led.SchDoc
size A; SheetNumber: 7; SheetTotal: 7
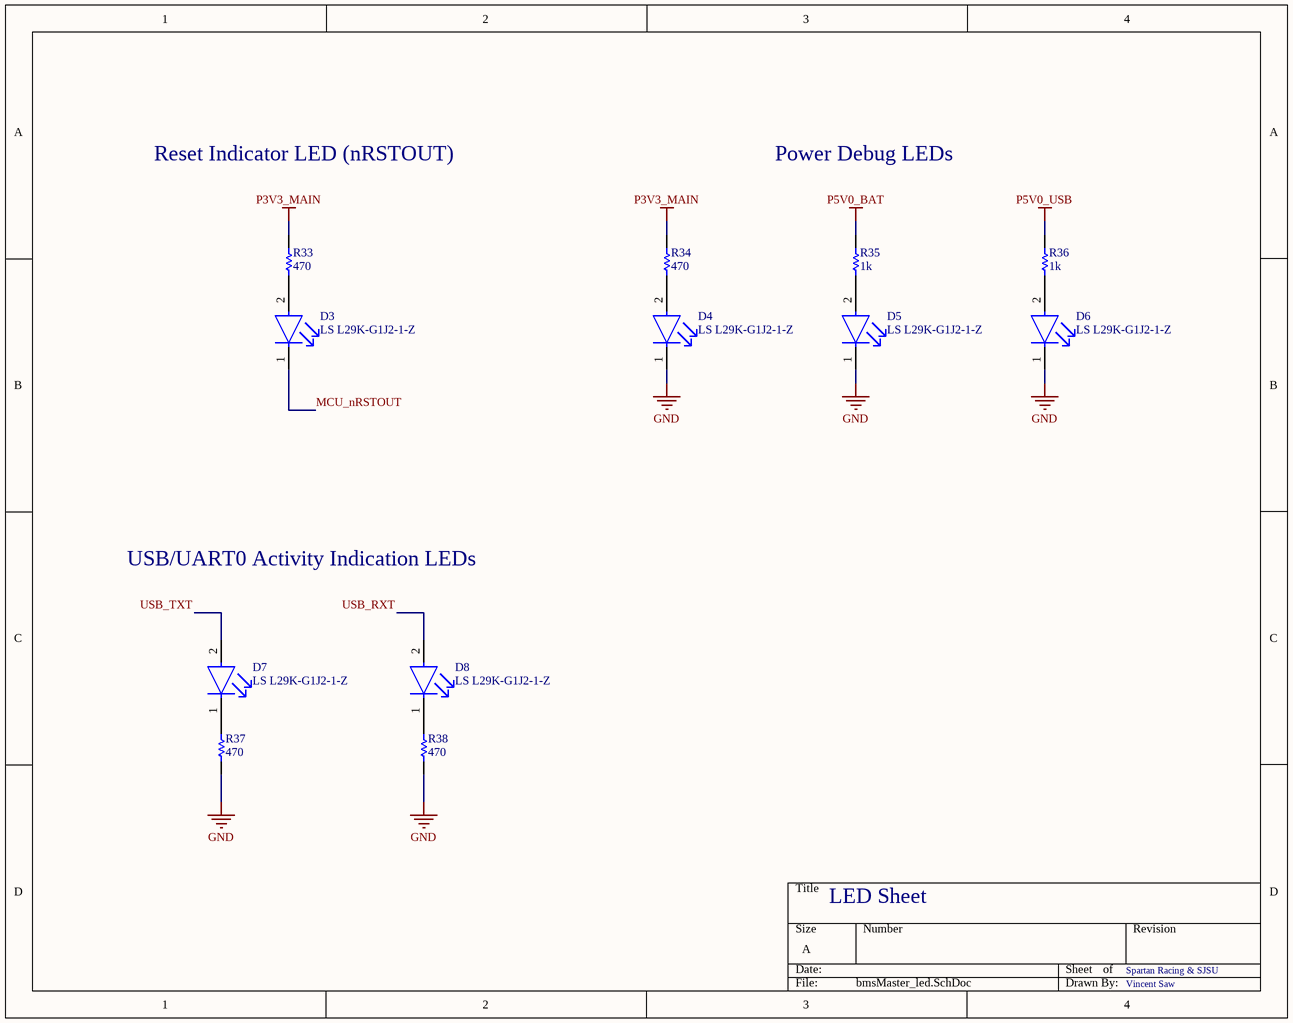
[diagram p6: bmsMaster_led.SchDoc]

### Parts
D3  LS L29K-G1J2-1-Z  [FP-LS_L29K-MFG]
D4  LS L29K-G1J2-1-Z  [FP-LS_L29K-MFG]
D5  LS L29K-G1J2-1-Z  [FP-LS_L29K-MFG]
D6  LS L29K-G1J2-1-Z  [FP-LS_L29K-MFG]
D7  LS L29K-G1J2-1-Z  [FP-LS_L29K-MFG]
D8  LS L29K-G1J2-1-Z  [FP-LS_L29K-MFG]
R33  value 470  [RESC1608X50N]  (hidden comment: Resistor)
R34  value 470  [RESC1608X50N]  (hidden comment: Resistor)
R35  value 1k  [RESC1608X50N]  (hidden comment: Resistor)
R36  value 1k  [RESC1608X50N]  (hidden comment: Resistor)
R37  value 470  [RESC1608X50N]  (hidden comment: Resistor)
R38  value 470  [RESC1608X50N]  (hidden comment: Resistor)

### Nets
GND: D4.1(C) D5.1(C) D6.1(C) R37.1 R38.1
P3V3_MAIN: R33.2 R34.2
P5V0_BAT: R35.2
P5V0_USB: R36.2
MCU_nRSTOUT: D3.1(C)
USB_RXT: D8.2(A)
USB_TXT: D7.2(A)
NetD3_2: D3.2(A) R33.1
NetD4_2: D4.2(A) R34.1
NetD5_2: D5.2(A) R35.1
NetD6_2: D6.2(A) R36.1
NetD7_1: D7.1(C) R37.2
NetD8_1: D8.1(C) R38.2

### Notes on the sheet
- Reset Indicator LED (nRSTOUT)
- Power Debug LEDs
- USB/UART0 Activity Indication LEDs
- LED Sheet
- Spartan Racing & SJSU
- Vincent Saw

### Library data of the parts
D3-D8 = CMP-62016-000014-1: LED RED DIFFUSED 0603 SMD; Manufacturer: Osram Opto; Luminous Flux: 0.0081/0.0254lm; Forward Voltage: 1.8V; Luminous Intensity: 1.8-2.24/5.6-7.1mcd; Reverse Voltage: 12V; Peak Emmision Wavelength: 643nm; Max Junction Temp: +110°C; Viewing Angle: 160°; Wavelength: 630nm; Forward Current: 2mA; Led Orientation: Top View; Category: Diode; Temperature Range High: +100°C; Automotive: No; Temperature: -40°C to +100°C; Device Class L3: unset; Mouser Description: LED Uni-Color Red 643nm Automotive 2-Pin SMD T/R; Manufacturer Part Number: LS L29K-G1J2-1-Z; ComponentLink2Description: Datasheet; Lead Free: Yes; Device Class L2: LEDs; ComponentLink2URL: https://dammedia.osram.info/media/resource/hires/osram-dam-5662679/LS%20L29K_EN.pdf; Temperature Range Low: -40°C; RoHS: TRUE; Digikey Description: LED RED DIFFUSED 0603 SMD; Colour: Red; Device Class L1: Optoelectronics; Package: LS_L29K; Octopart: https://octopart.com/ls+l29k-g1j2-1-z-osram+opto-31093939; Height: 0.67mm
R33-R38 = Resistor: TC1: 0; SimulationGenericComponent: True; TC2: 0

## Nets that join several sheets
GND: bmsMaster_main (26 pins), bmsMaster_conn (12 pins), bmsMaster_power (7 pins), bmsMaster_usb (6 pins), bmsMaster_isospi (10 pins), bmsMaster_can (6 pins), bmsMaster_led (5 pins)
P3V3_MAIN: bmsMaster_main (18 pins), bmsMaster_conn (J4.3 J5.3 P1.1), bmsMaster_power (C16.1 R11.1 TP18.1 U3.3), bmsMaster_usb (12 pins), bmsMaster_isospi (9 pins), bmsMaster_can (6 pins), bmsMaster_led (R33.2 R34.2)
P5V0_BAT: bmsMaster_conn (J3.3), bmsMaster_power (R9.2 TP15.1 U2.3 U2.5), bmsMaster_led (R35.2)
P5V0_USB: bmsMaster_conn (J6.1), bmsMaster_power (TP16.1 U2.6), bmsMaster_led (R36.2)
CAN_EXT_1_N: bmsMaster_conn (J7.4), bmsMaster_can (D1.2 R30.1 U5.6)
CAN_EXT_1_P: bmsMaster_conn (J7.2), bmsMaster_can (D1.1 R29.2 U5.7)
CAN_EXT_2_N: bmsMaster_conn (J8.4), bmsMaster_can (D2.2 R32.1 U6.6)
CAN_EXT_2_P: bmsMaster_conn (J8.2), bmsMaster_can (D2.1 R31.2 U6.7)
CAN_EXT_5V0_1: bmsMaster_conn (J7.3), bmsMaster_can (C29.2 C30.2 U5.8)
CAN_EXT_5V0_2: bmsMaster_conn (J8.3), bmsMaster_can (C34.2 C35.2 U6.8)
CAN_EXT_GND_1: bmsMaster_conn (J7.1), bmsMaster_can (5 pins)
CAN_EXT_GND_2: bmsMaster_conn (J8.1), bmsMaster_can (5 pins)
ISO_xA_N: bmsMaster_conn (J2.2), bmsMaster_isospi (T1.4)
ISO_xA_P: bmsMaster_conn (J2.1), bmsMaster_isospi (T1.6)
MCU_CAN_RX1: bmsMaster_main (IC1.37), bmsMaster_can (TP26.1 U5.2)
MCU_CAN_RX2: bmsMaster_main (IC1.51), bmsMaster_can (TP28.1 U6.2)
MCU_CAN_TX1: bmsMaster_main (IC1.38), bmsMaster_can (TP25.1 U5.3)
MCU_CAN_TX2: bmsMaster_main (IC1.50), bmsMaster_can (TP27.1 U6.3)
MCU_ISO_SPI0_MISO: bmsMaster_main (IC1.29), bmsMaster_isospi (IC2.3 R26.1 TP22.1)
MCU_ISO_SPI0_MOSI: bmsMaster_main (IC1.30), bmsMaster_isospi (IC2.2 TP21.1)
MCU_ISO_SPI0_nCS: bmsMaster_main (IC1.35), bmsMaster_isospi (IC2.5 TP24.1)
MCU_ISO_SPI0_SCK: bmsMaster_main (IC1.27), bmsMaster_isospi (IC2.4 TP23.1)
MCU_JTAG_nTRST: bmsMaster_main (IC1.4), bmsMaster_conn (P1.10)
MCU_JTAG_TCK: bmsMaster_main (IC1.5), bmsMaster_conn (P1.4)
MCU_JTAG_TDI: bmsMaster_main (IC1.2), bmsMaster_conn (P1.8)
MCU_JTAG_TDO: bmsMaster_main (IC1.1), bmsMaster_conn (P1.6)
MCU_JTAG_TMS: bmsMaster_main (IC1.3), bmsMaster_conn (P1.2)
MCU_nNMI: bmsMaster_main (IC1.41), bmsMaster_usb (R13.1 R17.1)
MCU_nRST: bmsMaster_main (5 pins), bmsMaster_usb (R16.1)
MCU_nRSTOUT: bmsMaster_main (IC1.11 TP7.1), bmsMaster_led (D3.1)
MCU_RXD0: bmsMaster_main (IC1.80), bmsMaster_usb (R15.1 TP20.1 U4.21)
MCU_RXD2: bmsMaster_main (IC1.40), bmsMaster_conn (J4.2)
MCU_RXD3: bmsMaster_main (IC1.68), bmsMaster_conn (J5.2)
MCU_TXD0: bmsMaster_main (IC1.79), bmsMaster_usb (R14.1 TP19.1 U4.20)
MCU_TXD2: bmsMaster_main (IC1.39), bmsMaster_conn (J4.4)
MCU_TXD3: bmsMaster_main (IC1.65), bmsMaster_conn (J5.4)
PMUX_ST: bmsMaster_main (IC1.46 TP10.1), bmsMaster_power (R11.2 U2.8)
USB_D_N: bmsMaster_conn (J6.2), bmsMaster_usb (U4.4)
USB_D_P: bmsMaster_conn (J6.3), bmsMaster_usb (U4.3)
USB_RXT: bmsMaster_usb (U4.13), bmsMaster_led (D8.2)
USB_TXT: bmsMaster_usb (U4.14), bmsMaster_led (D7.2)